# Altium schematic sheet Sheet1.SchDoc
size A4
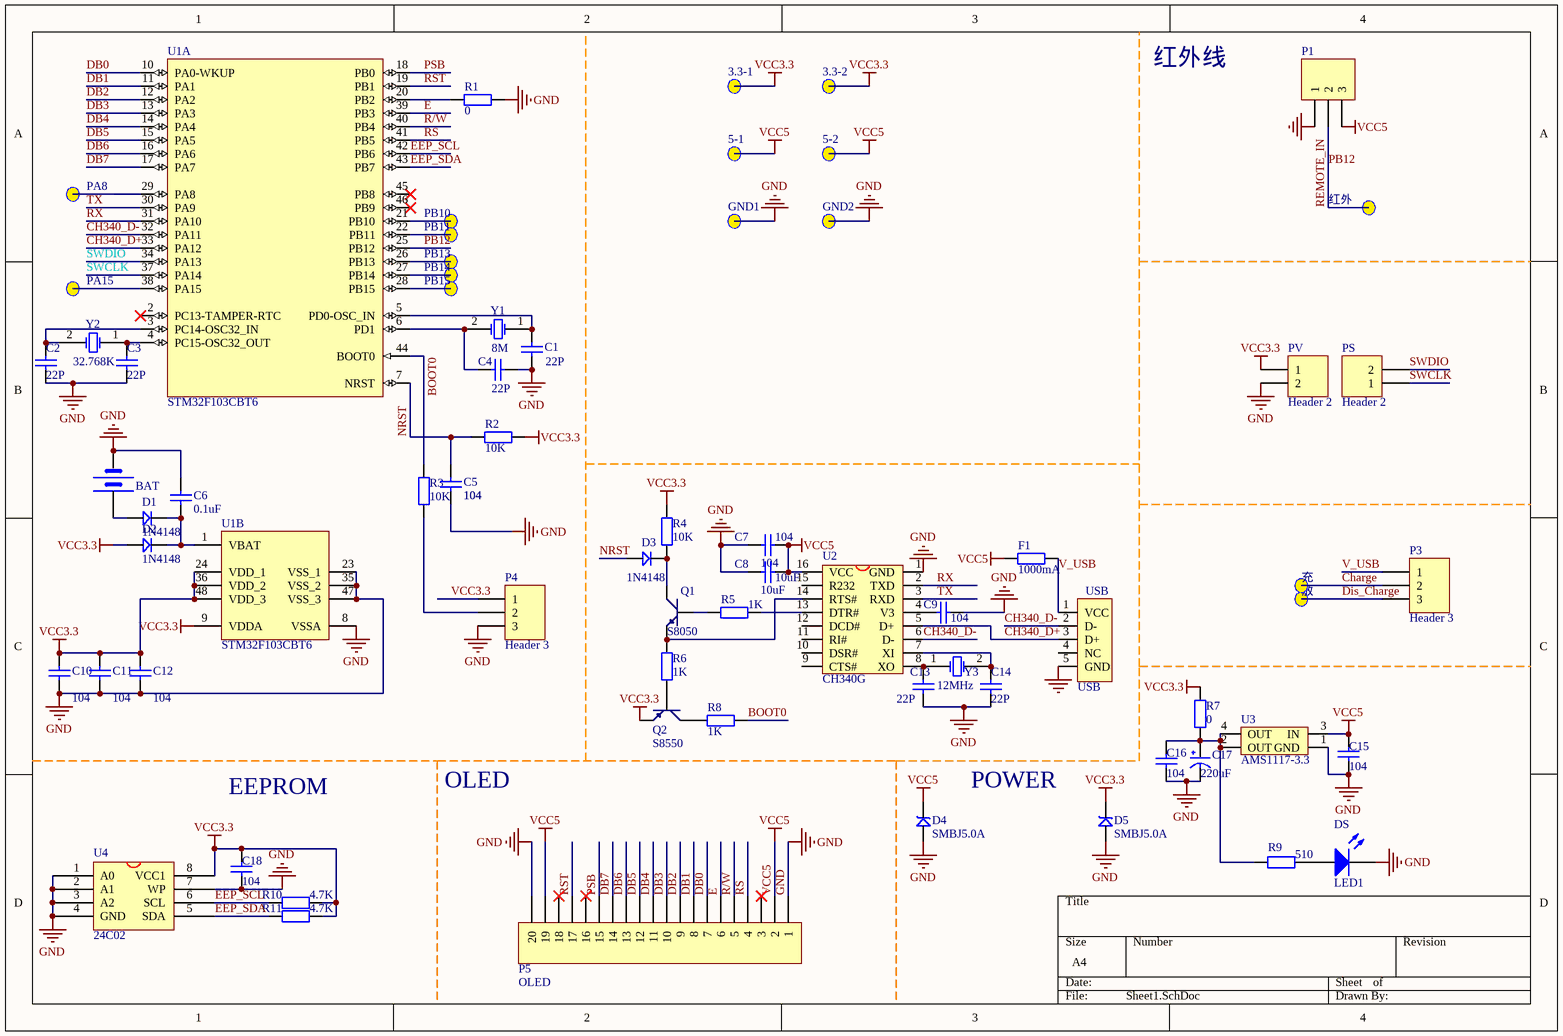
[diagram p0: Sheet1.SchDoc]

## Parts
3.3-1  TEST_PAD  [pin1]  (value not drawn)
3.3-2  TEST_PAD  [pin1]  (value not drawn)
5-1  TEST_PAD  [pin1]  (value not drawn)
5-2  TEST_PAD  [pin1]  (value not drawn)
BAT  BATT  [BATM]  (value not drawn)
C1  22P  [0603p]
C2  22P  [0603P]
C3  22P  [0603P]
C4  22P  [0603p]
C5  104  [0603p]
C6  0.1uF  [0603P]
C7  104  [0603p]
C8  10uF  [0603p]
C9  104  [0603P]
C10  104  [0603p]
C11  104  [0603p]
C12  104  [0603p]
C13  22P  [0603P]
C14  22P  [0603P]
C15  104  [0603P]
C16  104  [0603P]
C17  220uF  [CC6.56.5]
C18  104  [0603P]
D1  1N4148  [DIODE_SOP]
D2  1N4148  [DIODE_SOP]
D3  1N4148  [DIODE_SOP]
D4  SMBJ5.0A  [SMBJ]
D5  SMBJ5.0A  [SMBJ]
DS  LED1  [SMDLED]
F1  1000mA  [1206]
GND1  TEST_PAD  [pin1]  (value not drawn)
GND2  TEST_PAD  [pin1]  (value not drawn)
P1  Header 3  [HDR1X3]  (value not drawn)
P3  Header 3  [HDR1X3]
P4  Header 3  [2-1]
P5  OLED  [HDR1X20]
PA8  TEST_PAD  [pin1]  (value not drawn)
PA15  TEST_PAD  [pin1]  (value not drawn)
PB10  TEST_PAD  [pin1]  (value not drawn)
PB11  TEST_PAD  [pin1]  (value not drawn)
PB13  TEST_PAD  [pin1]  (value not drawn)
PB14  TEST_PAD  [pin1]  (value not drawn)
PB15  TEST_PAD  [pin1]  (value not drawn)
PS  Header 2  [HDR1X2]
PV  Header 2  [HDR1X2]
Q1  S8050  [SOT-23R]
Q2  S8550  [SOT-23R]
R1  0  [0603p]
R2  10K  [0603p]
R3  10K  [0603p]
R4  10K  [0603p]
R5  1K  [0603p]
R6  1K  [0603p]
R7  0  [0603P]
R8  1K  [0603p]
R9  510  [0603p]
R10  4.7K  [0603P]
R11  4.7K  [0603P]
U1  STM32F103CBT6  [LQFP48_M]  (parts A,B of 2)
U2  CH340G  [SOP16M]
U3  AMS1117-3.3  [AMS1117]
U4  24C02  [SOP-8]
USB  USB  [USB/SM0.8-6H5]
Y1  8M  [XTAL_US]
Y2  32.768K  [XTAL32]
Y3  12MHz  [XTAL_US]
充  TEST_PAD  [pin1]  (value not drawn)
放  TEST_PAD  [pin1]  (value not drawn)
红外  TEST_PAD  [pin1]  (value not drawn)

## Nets
GND: BAT.2(GND) C1.2 C2.2 C3.2 C4.1 C5.1 C6.1 C7.2 C8.2 C9.1 C10.1 C11.1 C12.1 C13.2 C14.2 C15.1 C16.1 C17.2(GND) C18.1 D4.1 D5.1 DS.2(K) GND1.1 GND2.1 P1.1 P4.3 P5.1 P5.20 PV.2 R1.2 U1.8(VSSA) U1.23(VSS_1) U1.35(VSS_2) U1.47(VSS_3) U2.1(GND) U3.1(GND) U4.1(A0) U4.2(A1) U4.3(A2) U4.4(GND) U4.7(WP) USB.5(GND)
VCC3.3: 3.3-1.1 3.3-2.1 C10.2 C11.2 C12.2 C18.2 D2.1 D5.2 P4.1 PV.1 Q2.1(E) R2.2 R4.2 R7.2 R10.2 R11.2 U1.9(VDDA) U1.24(VDD_1) U1.36(VDD_2) U1.48(VDD_3) U4.8(VCC1)
VCC5: 5-1.1 5-2.1 C7.1 C8.1 C15.2 D4.2 F1.2 P1.3 P5.2 P5.19 U2.16(VCC) U3.3(IN)
BOOT0: R3.2 R8.1 U1.44(BOOT0)
CH340_D+: U1.33(PA12) U2.5(D+) USB.3(D+)
CH340_D-: U1.32(PA11) U2.6(D-) USB.2(D-)
Charge: P3.2 充.1
DB0: P5.7 U1.10(PA0-WKUP)
DB1: P5.8 U1.11(PA1)
DB2: P5.9 U1.12(PA2)
DB3: P5.10 U1.13(PA3)
DB4: P5.11 U1.14(PA4)
DB5: P5.12 U1.15(PA5)
DB6: P5.13 U1.16(PA6)
DB7: P5.14 U1.17(PA7)
Dis_Charge: P3.3 放.1
E: P5.6 U1.39(PB3)
EEP_SCL: R10.1 U1.42(PB6) U4.6(SCL)
EEP_SDA: R11.1 U1.43(PB7) U4.5(SDA)
NRST: C5.2 D3.1 R2.1 U1.7(NRST)
PB12: P1.2 U1.25(PB12) 红外.1  [also labelled REMOTE_IN]
PSB: P5.15 U1.18(PB0)
R/W: P5.5 U1.40(PB4)
RS: P5.4 U1.41(PB5)
RST: P5.17 U1.19(PB1)
RX: U1.31(PA10) U2.2(TXD)
SWCLK: PS.1 U1.37(PA14)
SWDIO: PS.2 U1.34(PA13)
TX: U1.30(PA9) U2.3(RXD)
V_USB: F1.1 P3.1 USB.1(VCC)
NetBAT_1: BAT.1(VCC) D1.1
NetC1_1: C1.1 U1.5(PD0-OSC_IN) Y1.1(OSC1)
NetC2_1: C2.1 U1.3(PC14-OSC32_IN) Y2.2(OSC2)
NetC3_1: C3.1 U1.4(PC15-OSC32_OUT) Y2.1(OSC1)
NetC4_2: C4.2 U1.6(PD1) Y1.2(OSC2)
NetC6_2: C6.2 D1.2 D2.2 U1.1(VBAT)
NetC9_2: C9.2 U2.4(V3)
NetC13_1: C13.1 U2.8(XO) Y3.1(OSC1)
NetC14_1: C14.1 U2.7(XI) Y3.2(OSC2)
NetC16_2: C16.2 C17.1(VCC) R7.1 R9.1 U3.2(OUT) U3.4(OUT)
NetD3_2: D3.2 Q1.3(C) R4.1
NetDS_1: DS.1(A) R9.2
NetP4_2: P4.2 R3.1
NetPA8_1: PA8.1 U1.29(PA8)
NetPA15_1: PA15.1 U1.38(PA15)
NetPB10_1: PB10.1 U1.21(PB10)
NetPB11_1: PB11.1 U1.22(PB11)
NetPB13_1: PB13.1 U1.26(PB13)
NetPB14_1: PB14.1 U1.27(PB14)
NetPB15_1: PB15.1 U1.28(PB15)
NetQ1_1: Q1.1(E) R6.2 U2.14(RTS#)
NetQ1_2: Q1.2(B) R5.1
NetQ2_2: Q2.2(B) R6.1
NetQ2_3: Q2.3(C) R8.2
NetR1_1: R1.1 U1.20(PB2)
NetR5_2: R5.2 U2.13(DTR#)

Not connected (* = marked no-connect by the designer): P5 3* 16* 18*; U1 2(PC13-TAMPER-RTC)* 45(PB8)* 46(PB9)*; U2 9(CTS#) 10(DSR#) 11(RI#) 12(DCD#) 15(R232); USB 4(NC)

## Notes on the sheet
- 红外线
- OLED
- POWER
- EEPROM

## Library data of the parts
BAT = BAT
C1-C16 C18 = Cap: Capacitor; Published: 8-Jun-2000; LatestRevisionDate: 17-Jul-2002; LatestRevisionNote: Re-released for DXP Platform.; PackageReference: RAD-0.3; Publisher: Altium Limited
  C1 C4: PackageDescription: Radial Cap, Thru-Hole; 2 Leads; 0.3 in Pin Spacing; Value: 22P
  C2 C3 C13 C14: Value: 22P
  C5 C7 C10-C12: PackageDescription: Radial Cap, Thru-Hole; 2 Leads; 0.3 in Pin Spacing; Value: 104
  C6: Value: 0.1uF
  C8: PackageDescription: Radial Cap, Thru-Hole; 2 Leads; 0.3 in Pin Spacing; Value: 10uF
  C9 C15 C16 C18: Value: 104
C17 = CAP
D1-D3 = D
D4 D5 = SMBJ: TVS
DS = LED2: Typical RED, GREEN, YELLOW, AMBER GaAs LED; Published: 8-Jun-2000; LatestRevisionDate: 17-Jul-2002; LatestRevisionNote: Re-released for DXP Platform.; PackageDocument: Feb-2002; PackageReference: 3.2X1.6X1.1; Publisher: Altium Limited
F1 R1-R11 = Res2: Resistor; Published: 8-Jun-2000; LatestRevisionDate: 17-Jul-2002; LatestRevisionNote: Re-released for DXP Platform.; PackageReference: AXIAL-0.4; Publisher: Altium Limited
  F1: Value: 1000mA
  R1 R7: Value: 0
  R2-R4: Value: 10K
  R5 R6 R8: Value: 1K
  R9: Value: 510
  R10 R11: Value: 4.7K
P1 P3 P4 = Header 3: Header, 3-Pin; LatestRevisionDate: 17-Jul-2002; LatestRevisionNote: Re-released for DXP Platform.; Publisher: Altium Limited
P5 = Header 20: Header, 20-Pin; LatestRevisionDate: 17-Jul-2002; LatestRevisionNote: Re-released for DXP Platform.; Publisher: Altium Limited
PS PV = Header 2: Header, 2-Pin; LatestRevisionDate: 17-Jul-2002; LatestRevisionNote: Re-released for DXP Platform.; Publisher: Altium Limited
Q1 = NPN: 8050/BCW846/BCW847
Q2 = PNP: 8550/BCW68
U1 = STM32F103CBT6: STM32 ARM-based 32-bit MCU Performance Line with 128 kB Flash, 20 kB Internal RAM, -40 to +85°C Temperature, 48-Pin LQFP, Tray; DatasheetVersion: rev13.0, Apr-2011; PackageVersion: rev13, Apr-2011; PackageReference: LQFP48; PackageDescription: 48-Pin Low-Profile Quad Flat Pack, 7 x 7 mm Body, 0.5 mm Pitch (LQFP48); ComponentLink1Description: Manufacturer URL; ComponentLink1URL: http://www.st.com/; ComponentLink2Description: STM32F103 Datasheet; ComponentLink2URL: http://www.st.com/internet/com/TECHNICAL_RESOURCES/TECHNICAL_LITERATURE/DATASHEET/CD00161566.pdf; ComponentLink3Description: STM32 Family Web Page; ComponentLink3URL: www.st.com/stm32
U2 = CH340G: USB2UART
U3 = AMS1117
U4 = 24C256
USB = USB5
Y1-Y3 = XTAL: Crystal Oscillator; Published: 8-Jun-2000; LatestRevisionDate: 17-Jul-2002; LatestRevisionNote: Re-released for DXP Platform.; Publisher: Altium Limited
  Y1 Y2: PackageReference: R38; PackageDescription: Crystal, Thru-Hole; 2 Leads; Body 3.1 x 8.2 mm (Dia.xH)